# Altium schematic sheet mcu.SchDoc
size A4
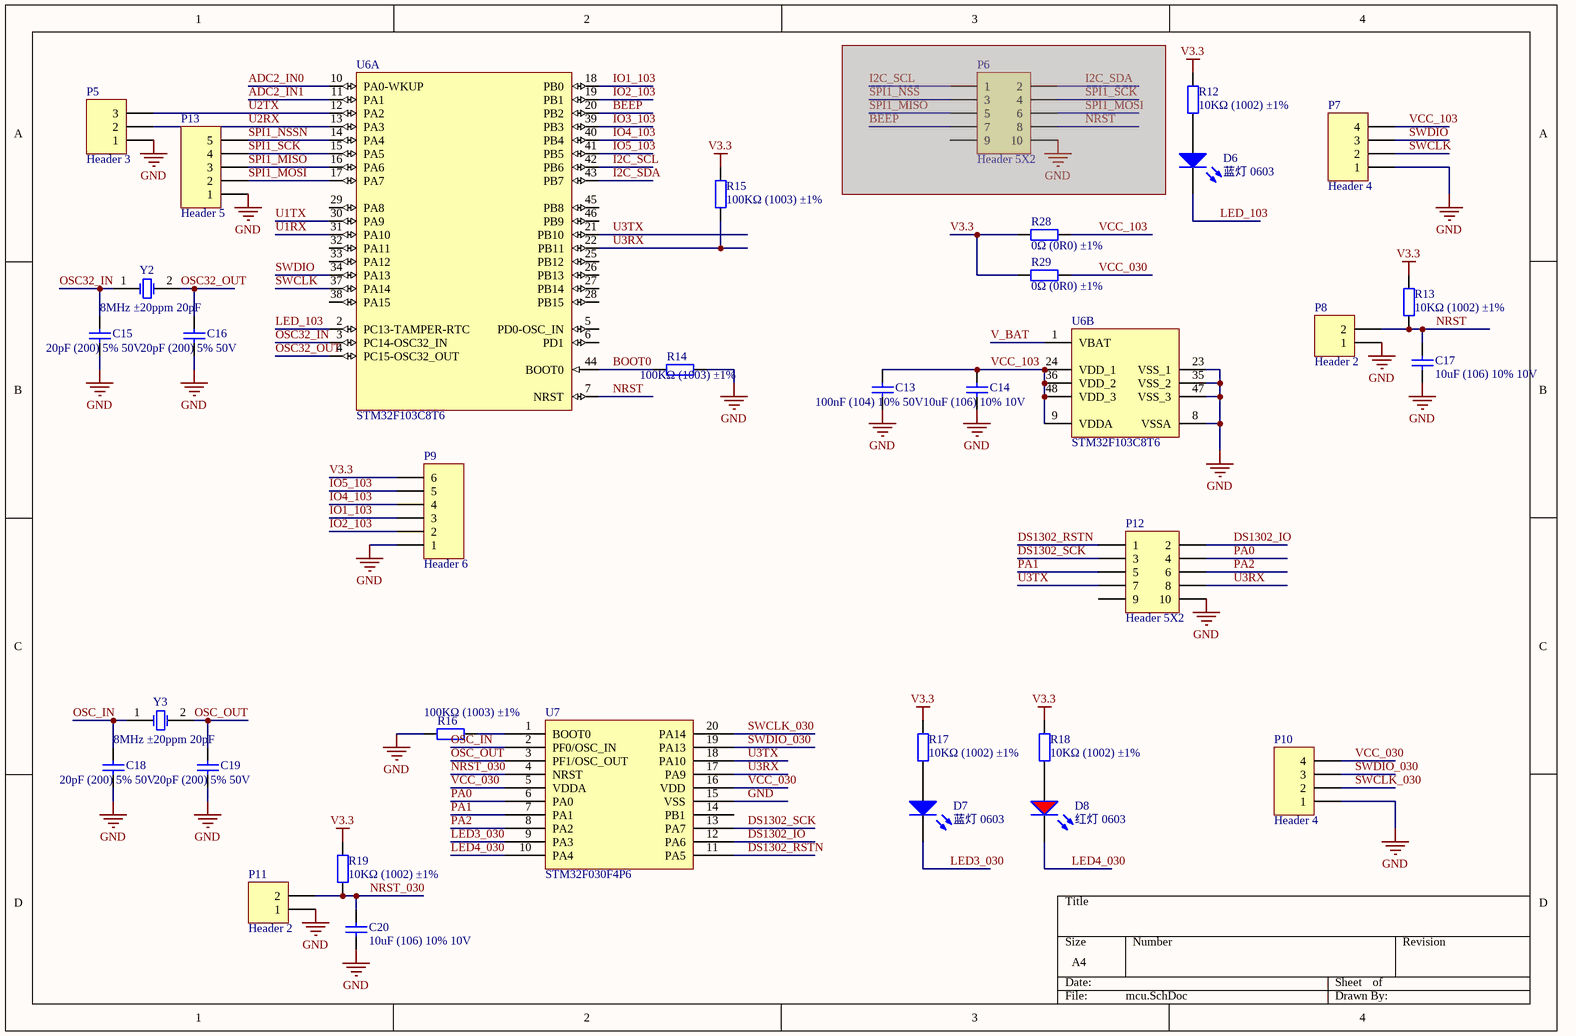
[diagram p0: mcu.SchDoc]

## Parts
C13  100nF (104) 10% 50V  [0603_C]
C14  10uF (106) 10% 10V  [0603_C]
C15  20pF (200) 5% 50V  [0402_C]
C16  20pF (200) 5% 50V  [0402_C]
C17  10uF (106) 10% 10V  [0603_C]
C18  20pF (200) 5% 50V  [0402_C]
C19  20pF (200) 5% 50V  [0402_C]
C20  10uF (106) 10% 10V  [0603_C]
D6  蓝灯 0603  [0603_LED_S1]
D7  蓝灯 0603  [0603_LED_S1]
D8  红灯 0603  [0603_LED_S1]
P5  Header 3  [HDR1X3]
P6  Header 5X2  [HDR2X5]  (masked out: inside a compile mask, not in the netlist)
P7  Header 4  [HDR1X4]
P8  Header 2  [HDR1X2]
P9  Header 6  [HDR1X6]
P10  Header 4  [HDR1X4]
P11  Header 2  [HDR1X2]
P12  Header 5X2  [HDR2X5]
P13  Header 5  [HDR1X5]
R12  10KΩ (1002) ±1%  [0402_R]
R13  10KΩ (1002) ±1%  [0402_R]
R14  100KΩ (1003) ±1%  [0603_R]
R15  100KΩ (1003) ±1%  [0402_R]
R16  100KΩ (1003) ±1%  [0402_R]
R17  10KΩ (1002) ±1%  [0402_R]
R18  10KΩ (1002) ±1%  [0402_R]
R19  10KΩ (1002) ±1%  [0402_R]
R28  0Ω (0R0) ±1%  [1206_R]
R29  0Ω (0R0) ±1%  [1206_R]
U6  STM32F103C8T6  [LQFP-48_7x7x05P]  (parts A,B of 2)
U7  STM32F030F4P6  [TSSOP-20]
Y2  8MHz ±20ppm 20pF  [SMD-5032_2P]
Y3  8MHz ±20ppm 20pF  [SMD-5032_2P]

## Nets
GND: C13.1 C14.2 C15.1 C16.1 C17.1 C18.1 C19.1 C20.1 P5.1 P7.1 P8.1 P9.1 P10.1 P11.1 P12.10 P13.1 R14.2 R16.1 U6.8(VSSA) U6.23(VSS_1) U6.35(VSS_2) U6.47(VSS_3) U7.15(VSS)
V3.3: P9.6 R12.2 R13.2 R15.2 R17.2 R18.2 R19.2 R28.1 R29.1
ADC2_IN0: U6.10(PA0-WKUP)
ADC2_IN1: U6.11(PA1)
BEEP: U6.20(PB2)
BOOT0: R14.1 U6.44(BOOT0)
DS1302_IO: P12.2 U7.12(PA6)
DS1302_RSTN: P12.1 U7.11(PA5)
DS1302_SCK: P12.3 U7.13(PA7)
I2C_SCL: U6.42(PB6)
I2C_SDA: U6.43(PB7)
IO1_103: P9.3 U6.18(PB0)
IO2_103: P9.2 U6.19(PB1)
IO3_103: U6.39(PB3)
IO4_103: P9.4 U6.40(PB4)
IO5_103: P9.5 U6.41(PB5)
LED3_030: D7.K U7.9(PA3)
LED4_030: D8.K U7.10(PA4)
LED_103: D6.K U6.2(PC13-TAMPER-RTC)
NRST: C17.2 P8.2 R13.1 U6.7(NRST)
NRST_030: C20.2 P11.2 R19.1 U7.4(NRST)
OSC32_IN: C15.2 U6.3(PC14-OSC32_IN) Y2.1(OSC1)
OSC32_OUT: C16.2 U6.4(PC15-OSC32_OUT) Y2.2(OSC2)
OSC_IN: C18.2 U7.2(PF0/OSC_IN) Y3.1(OSC1)
OSC_OUT: C19.2 U7.3(PF1/OSC_OUT) Y3.2(OSC2)
PA0: P12.4 U7.6(PA0)
PA1: P12.5 U7.7(PA1)
PA2: P12.6 U7.8(PA2)
SPI1_MISO: P13.3 U6.16(PA6)
SPI1_MOSI: P13.2 U6.17(PA7)
SPI1_NSSN: P13.5 U6.14(PA4)
SPI1_SCK: P13.4 U6.15(PA5)
SWCLK: P7.2 U6.37(PA14)
SWCLK_030: P10.2 U7.20(PA14)
SWDIO: P7.3 U6.34(PA13)
SWDIO_030: P10.3 U7.19(PA13)
U1RX: U6.31(PA10)
U1TX: U6.30(PA9)
U2RX: P5.2 U6.13(PA3)
U2TX: P5.3 U6.12(PA2)
U3RX: P12.8 R15.1 U6.22(PB11) U7.17(PA9)
U3TX: P12.7 U6.21(PB10) U7.18(PA10)
V_BAT: U6.1(VBAT)
VCC_030: P10.4 R29.2 U7.5(VDDA) U7.16(VDD)
VCC_103: C13.2 C14.1 P7.4 R28.2 U6.9(VDDA) U6.24(VDD_1) U6.36(VDD_2) U6.48(VDD_3)
NetD6_A: D6.A R12.1
NetD7_A: D7.A R17.1
NetD8_A: D8.A R18.1
NetR16_2: R16.2 U7.1(BOOT0)

Not connected (* = marked no-connect by the designer): P12 9; U6 5(PD0-OSC_IN) 6(PD1) 25(PB12) 26(PB13) 27(PB14) 28(PB15) 29(PA8) 32(PA11) 33(PA12) 38(PA15) 45(PB8) 46(PB9); U7 14(PB1)

## Library data of the parts
C13 = 0603 100nF (104) 10% 50V: 贴片电容; ComponentLink1Description: 供应商链接; ComponentLink1URL: http://www.szlcsc.com/product/details_15331.html; Package: 0603; Supplier: LC; SuppliersPartNumber: C14663
C14 C17 C20 = 0603 10uF (106) 10% 10V: 贴片电容; ComponentLink1Description: 供应商链接; ComponentLink1URL: http://www.szlcsc.com/product/details_20411.html; Package: 0603; Supplier: LC; SuppliersPartNumber: C19702
C15 C16 C18 C19 = 0402 20pF (200) 5% 50V: 贴片电容; ComponentLink1Description: 供应商链接; ComponentLink1URL: http://www.szlcsc.com/product/details_1906.html; Package: 0402; Supplier: LC; SuppliersPartNumber: C1554
D6 D7 = 0603 蓝灯: 发光二极管; ComponentLink1Description: 供应商链接; ComponentLink1URL: http://www.szlcsc.com/product/details_73150.html; Package: 0603; Supplier: LC; SuppliersPartNumber: C72041
D8 = 0603 红灯: 发光二极管; ComponentLink1Description: 供应商链接; ComponentLink1URL: http://www.szlcsc.com/product/details_2659.html; Package: 0603; Supplier: LC; SuppliersPartNumber: C2286
P5 = Header 3: Header, 3-Pin; LatestRevisionDate: 17-Jul-2002; LatestRevisionNote: Re-released for DXP Platform.; Publisher: Altium Limited
P6 P12 = Header 5X2: Header, 5-Pin, Dual row; LatestRevisionDate: 17-Jul-2002; LatestRevisionNote: Re-released for DXP Platform.; Publisher: Altium Limited
P7 P10 = Header 4: Header, 4-Pin; LatestRevisionDate: 17-Jul-2002; LatestRevisionNote: Re-released for DXP Platform.; Publisher: Altium Limited
P8 P11 = Header 2: Header, 2-Pin; LatestRevisionDate: 17-Jul-2002; LatestRevisionNote: Re-released for DXP Platform.; Publisher: Altium Limited
P9 = Header 6: Header, 6-Pin; LatestRevisionDate: 17-Jul-2002; LatestRevisionNote: Re-released for DXP Platform.; Publisher: Altium Limited
P13 = Header 5: Header, 5-Pin; LatestRevisionDate: 17-Jul-2002; LatestRevisionNote: Re-released for DXP Platform.; Publisher: Altium Limited
R12 R13 R17-R19 = 0402 10KΩ (1002) 1%: 贴片电阻; ComponentLink1Description: 供应商链接; ComponentLink1URL: http://www.szlcsc.com/product/details_26487.html; Package: 0402; Supplier: LC; SuppliersPartNumber: C25744
R14 = 0603 100KΩ (1003) 1%: 贴片电阻; ComponentLink1Description: 供应商链接; ComponentLink1URL: http://www.szlcsc.com/product/details_26546.html; Package: 0603; Supplier: LC; SuppliersPartNumber: C25803
R15 R16 = 0402 100KΩ (1003) 1%: 贴片电阻; ComponentLink1Description: 供应商链接; ComponentLink1URL: http://www.szlcsc.com/product/details_26484.html; Package: 0402; Supplier: LC; SuppliersPartNumber: C25741
R28 R29 = 1206 0Ω (0R0) 1%: 贴片电阻; ComponentLink1Description: 供应商链接; ComponentLink1URL: http://www.szlcsc.com/product/details_18576.html; Package: 1206; Supplier: LC; SuppliersPartNumber: C17888
U6 = STM32F103C8T6: ARM; ComponentLink1Description: 供应商链接; ComponentLink1URL: http://www.szlcsc.com/product/details_9243.html; Package: LQFP-48_7x7x05P; Supplier: LC; SuppliersPartNumber: C8734
U7 = STM32F030F4P6: ARM; ComponentLink1Description: 供应商链接; ComponentLink1URL: http://www.szlcsc.com/product/details_33873.html; Package: TSSOP-20; Supplier: LC; SuppliersPartNumber: C32908
Y2 Y3 = SMD-5032_2P 8MHz 20ppm 20pF: 贴片晶振; ComponentLink1Description: 供应商链接; ComponentLink1URL: http://www.szlcsc.com/product/details_117214.html; Package: SMD-5032_2P; Supplier: LC; SuppliersPartNumber: C115962